# Altium schematic sheet lora RAK3172.SchDoc
size A3
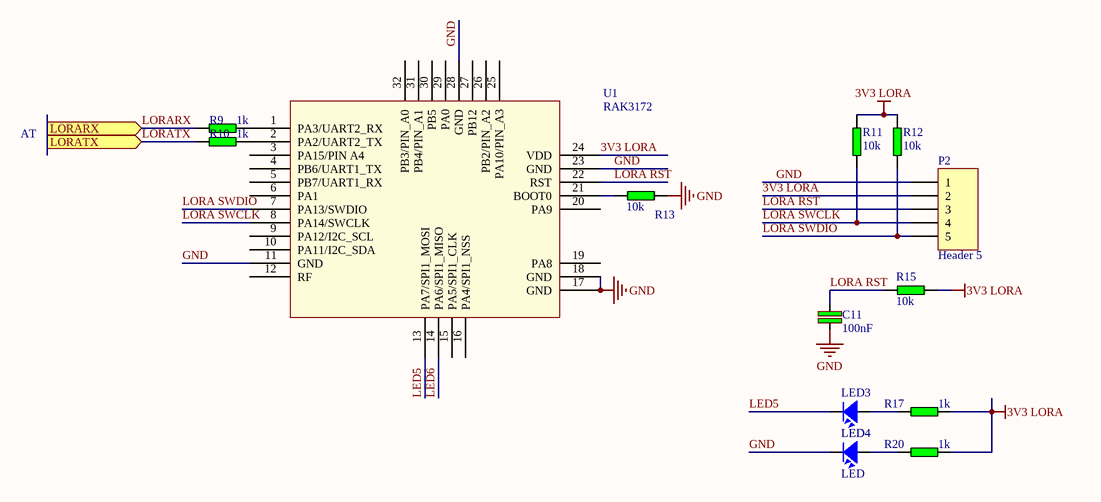
[diagram p0: lora RAK3172.SchDoc]

## Parts
C11  100nF  [0603 CAP]
LED3  LED  [LED-0805-Red]
LED4  LED  [LED-0805-Red]
P2  Header 5  [Jump5]
R9  1k  [0603 RESISTOR]
R10  1k  [0603 RESISTOR]
R11  10k  [0603 RESISTOR]
R12  10k  [0603 RESISTOR]
R13  10k  [0603 RESISTOR]
R15  10k  [0603 RESISTOR]
R17  1k  [0603 RESISTOR]
R20  1k  [0603 RESISTOR]
U1  RAK3172  [RAK3172]

## Ports
LORARX (in), LORATX (in)

## Nets
3V3 LORA: P2.2 R11.1 R12.1 R15.2 R17.2 R20.2 U1.24(VDD)
GND: C11.2 LED4.2 P2.1 R13.1 U1.11(GND) U1.17(GND) U1.18(GND) U1.23(GND) U1.28(GND)
LED5: LED3.2 U1.13(PA7/SPI1_MOSI)
LED6: U1.14(PA6/SPI1_MISO)
LORA RST: C11.1 P2.3 R15.1 U1.22(RST)
LORA SWCLK: P2.4 R11.2 U1.8(PA14/SWCLK)
LORA SWDIO: P2.5 R12.2 U1.7(PA13/SWDIO)
LORARX: R9.1 ; port LORARX
LORATX: R10.1 ; port LORATX
NetLED3_1: LED3.1 R17.1
NetLED4_1: LED4.1 R20.1
NetR9_2: R9.2 U1.1(PA3/UART2_RX)
NetR10_2: R10.2 U1.2(PA2/UART2_TX)
NetR13_2: R13.2 U1.21(BOOT0)

Not connected (* = marked no-connect by the designer): U1 3(PA15/PIN_A4) 4(PB6/UART1_TX) 5(PB7/UART1_RX) 6(PA1) 9(PA12/I2C_SCL) 10(PA11/I2C_SDA) 12(RF) 15(PA5/SPI1_CLK) 16(PA4/SPI1_NSS) 19(PA8) 20(PA9) 25(PA10/PIN_A3) 26(PB2/PIN_A2) 27(PB12) 29(PA0) 30(PB5) 31(PB4/PIN_A1) 32(PB3/PIN_A0)

## Notes on the sheet
- AT

## Library data of the parts
C11 = C: Cap SMD; Value: 103
LED3 LED4 = LED: LED Single colour Green and Red; Value: LED 3 ly Single Colour
P2 = Header 5: Header, 5-Pin; LatestRevisionDate: 17-Jul-2002; LatestRevisionNote: Re-released for DXP Platform.; Publisher: Altium Limited
R9-R13 R15 R17 R20 = RES: Resistor 1/4W; Value: R1/4W - 1K
U1 = RAK3172: LORA MODULE